# Altium schematic sheet STM32H750IBK6.SchDoc
size A2; SheetNumber: 1; SheetTotal: 2
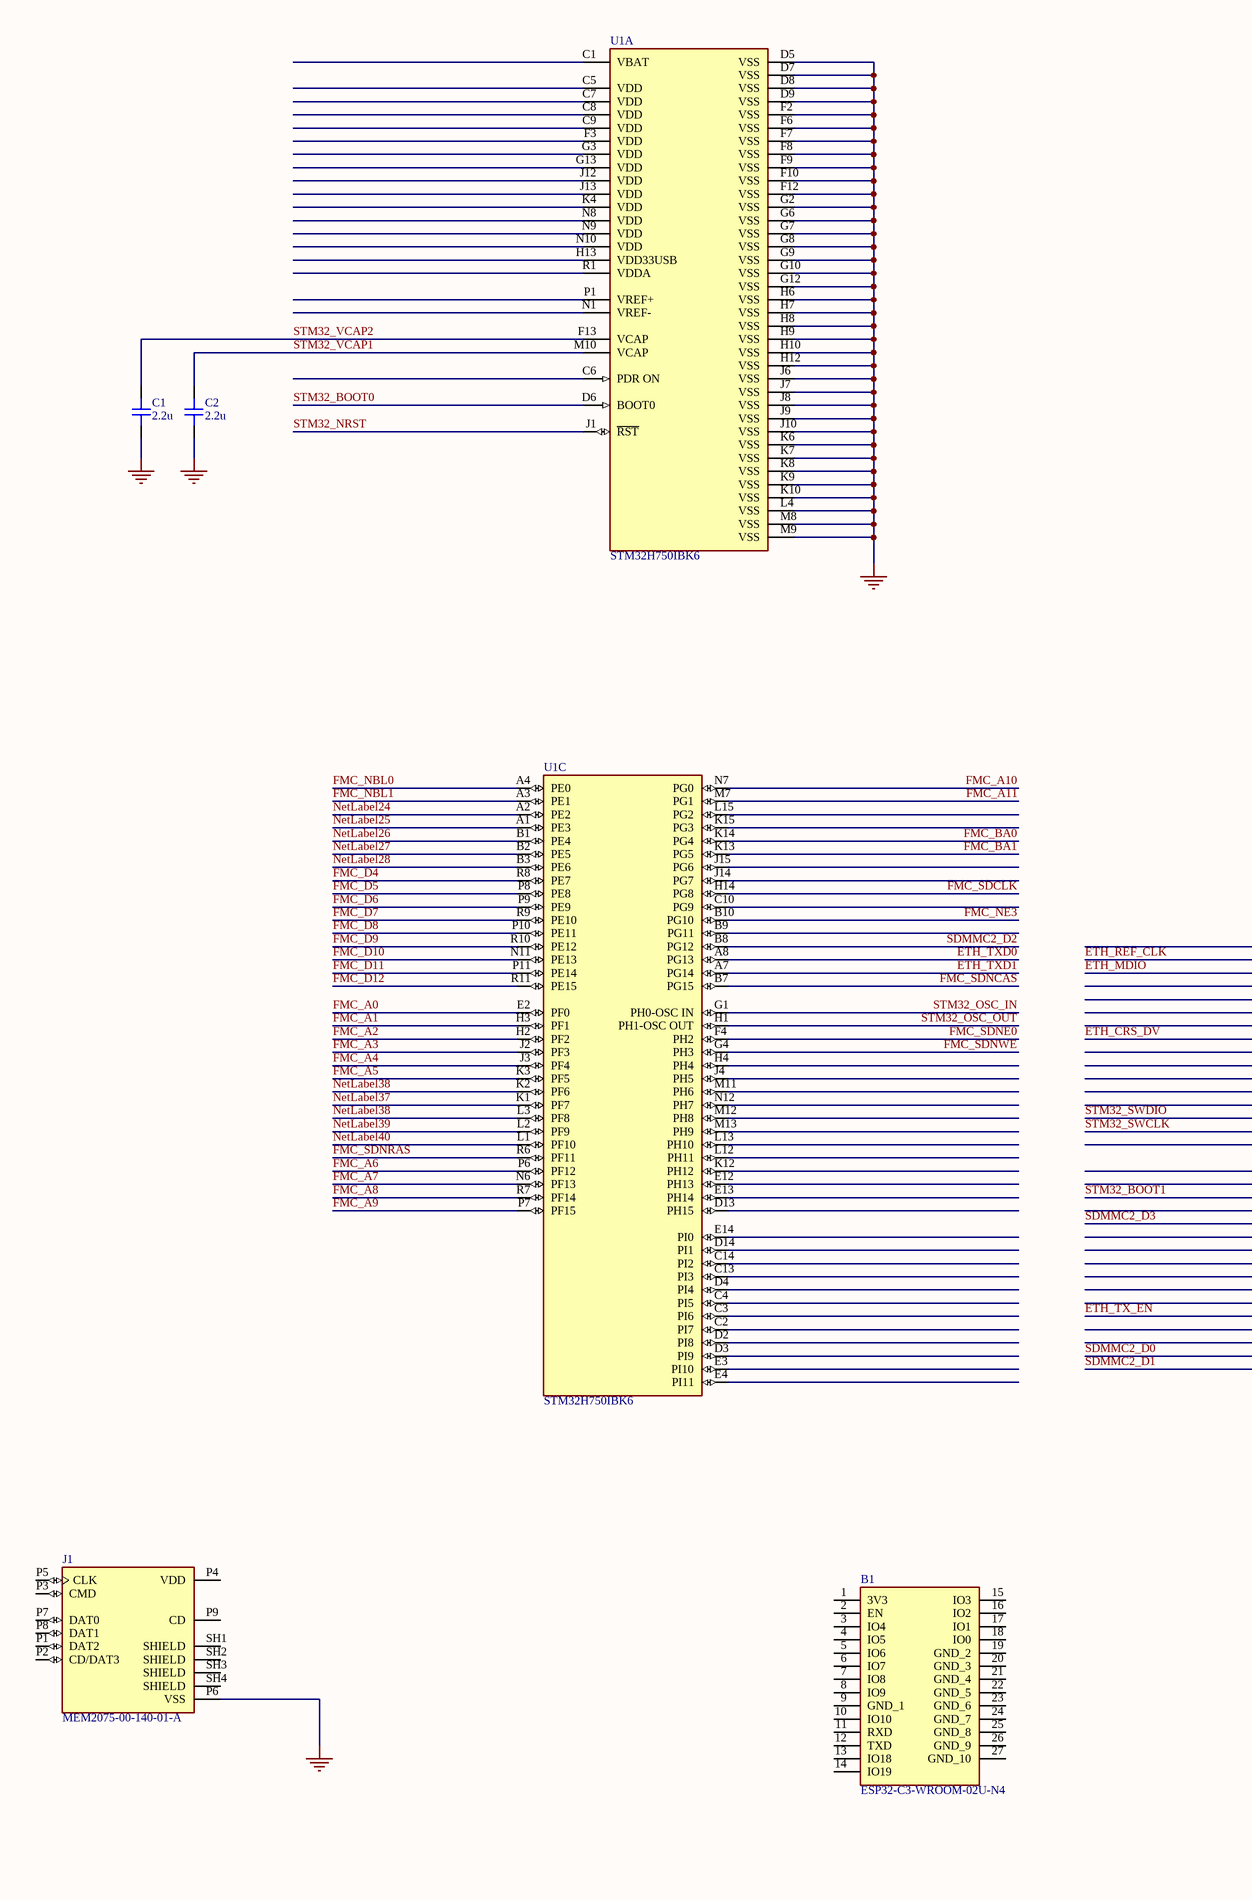
[diagram p0: STM32H750IBK6.SchDoc, left]
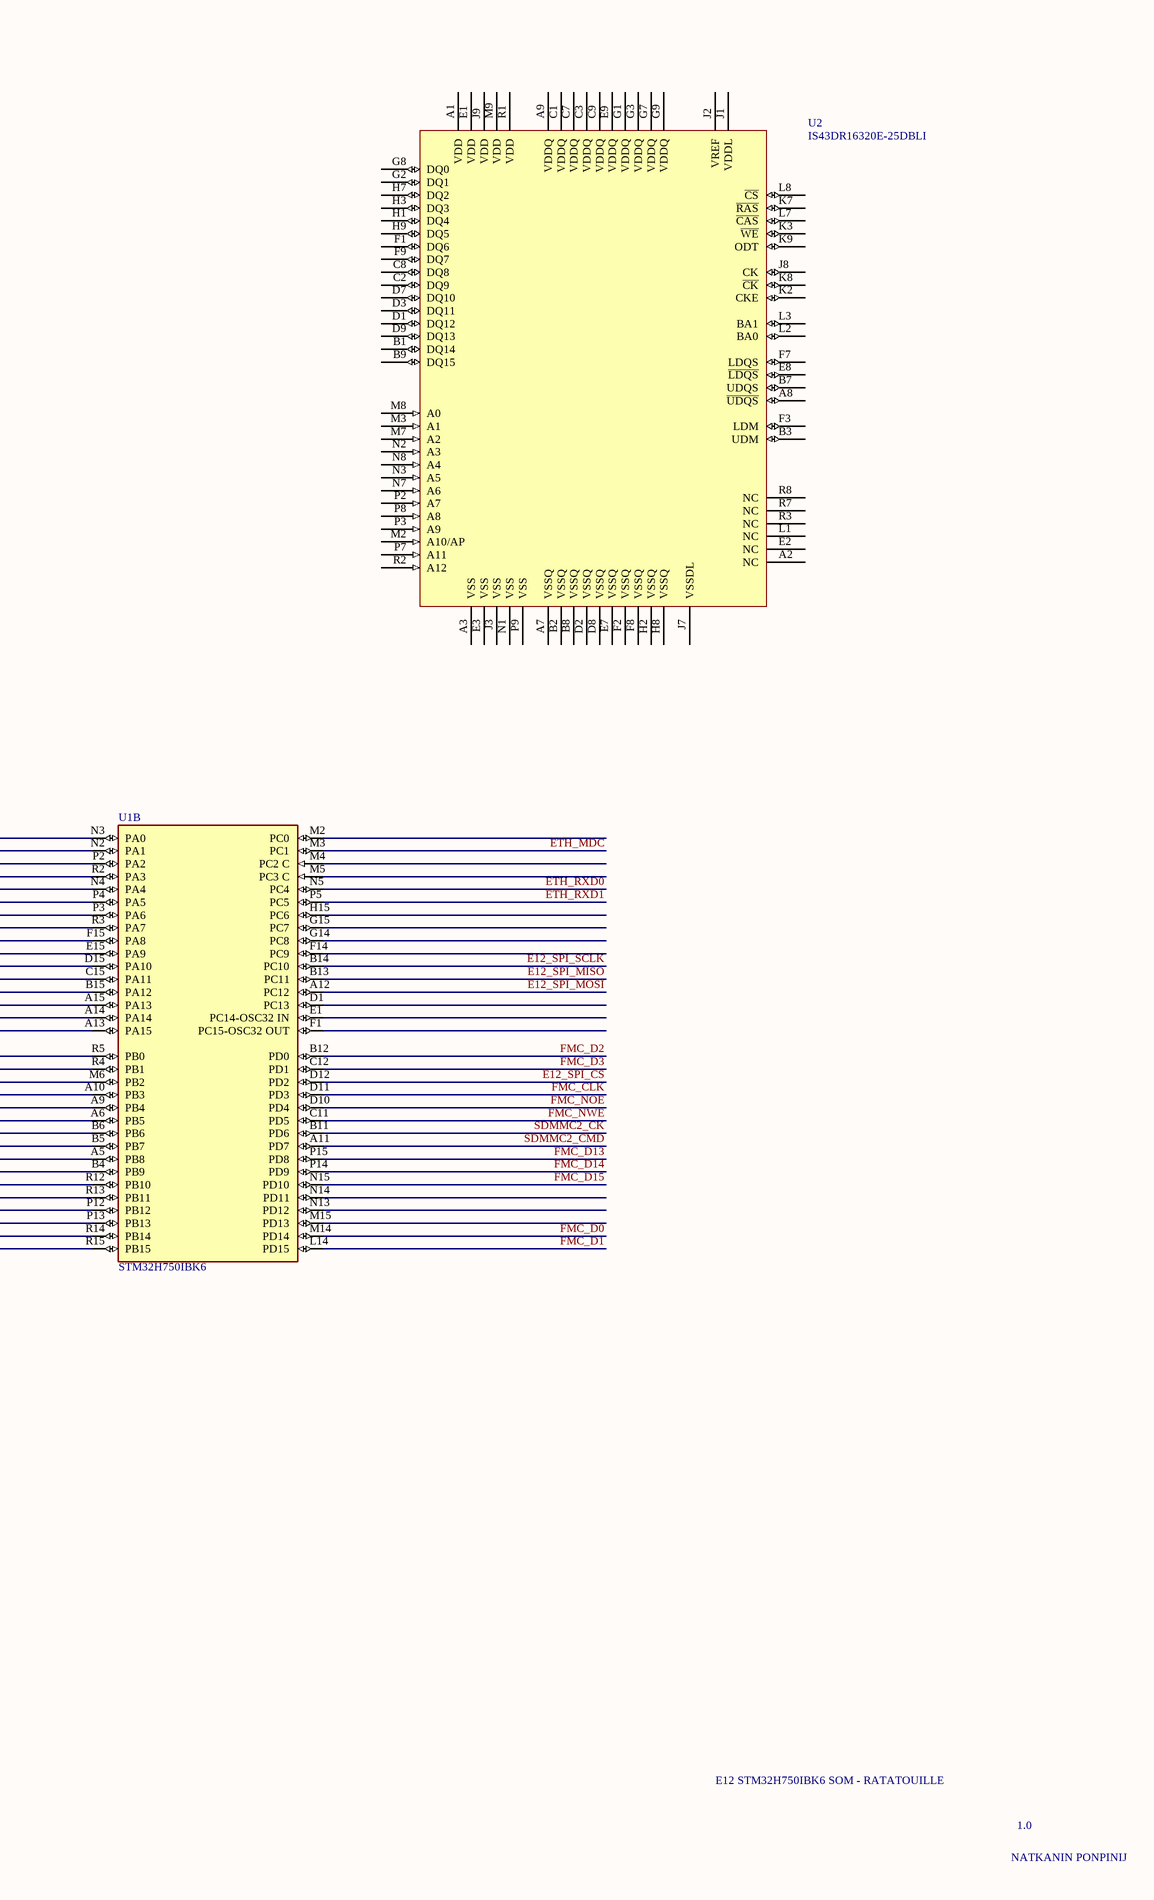
[diagram p1: STM32H750IBK6.SchDoc, right]

## Parts
B1  ESP32-C3-WROOM-02U-N4  [ESP32C3WROOM02UN4]
C1  2.2u  [CAP_0402]
C2  2.2u  [CAP_0402]
J1  MEM2075-00-140-01-A  [GCT_MEM2075-00-140-01-A]
U1  STM32H750IBK6  [FP-UFBGA176+25-A0E7-MFG]  (parts A,B,C of 3)
U2  IS43DR16320E-25DBLI  [BGA84C80P9X15_800X1250X120]

## Nets
GND: C1.1 C2.1 J1.P6(VSS) U1.D5(VSS) U1.D7(VSS) U1.D8(VSS) U1.D9(VSS) U1.F2(VSS) U1.F6(VSS) U1.F7(VSS) U1.F8(VSS) U1.F9(VSS) U1.F10(VSS) U1.F12(VSS) U1.G2(VSS) U1.G6(VSS) U1.G7(VSS) U1.G8(VSS) U1.G9(VSS) U1.G10(VSS) U1.G12(VSS) U1.H6(VSS) U1.H7(VSS) U1.H8(VSS) U1.H9(VSS) U1.H10(VSS) U1.H12(VSS) U1.J6(VSS) U1.J7(VSS) U1.J8(VSS) U1.J9(VSS) U1.J10(VSS) U1.K6(VSS) U1.K7(VSS) U1.K8(VSS) U1.K9(VSS) U1.K10(VSS) U1.L4(VSS) U1.M8(VSS) U1.M9(VSS)
E12_SPI_CS: U1.D12(PD2)
E12_SPI_MISO: U1.B13(PC11)
E12_SPI_MOSI: U1.A12(PC12)
E12_SPI_SCLK: U1.B14(PC10)
ETH_CRS_DV: U1.R3(PA7)
ETH_MDC: U1.M3(PC1)
ETH_MDIO: U1.P2(PA2)
ETH_REF_CLK: U1.N2(PA1)
ETH_RXD0: U1.N5(PC4)
ETH_RXD1: U1.P5(PC5)
ETH_TX_EN: U1.R13(PB11)
ETH_TXD0: U1.A8(PG13)
ETH_TXD1: U1.A7(PG14)
FMC_A0: U1.E2(PF0)
FMC_A1: U1.H3(PF1)
FMC_A2: U1.H2(PF2)
FMC_A3: U1.J2(PF3)
FMC_A4: U1.J3(PF4)
FMC_A5: U1.K3(PF5)
FMC_A6: U1.P6(PF12)
FMC_A7: U1.N6(PF13)
FMC_A8: U1.R7(PF14)
FMC_A9: U1.P7(PF15)
FMC_A10: U1.N7(PG0)
FMC_A11: U1.M7(PG1)
FMC_BA0: U1.K14(PG4)
FMC_BA1: U1.K13(PG5)
FMC_CLK: U1.D11(PD3)
FMC_D0: U1.M14(PD14)
FMC_D1: U1.L14(PD15)
FMC_D2: U1.B12(PD0)
FMC_D3: U1.C12(PD1)
FMC_D4: U1.R8(PE7)
FMC_D5: U1.P8(PE8)
FMC_D6: U1.P9(PE9)
FMC_D7: U1.R9(PE10)
FMC_D8: U1.P10(PE11)
FMC_D9: U1.R10(PE12)
FMC_D10: U1.N11(PE13)
FMC_D11: U1.P11(PE14)
FMC_D12: U1.R11(PE15)
FMC_D13: U1.P15(PD8)
FMC_D14: U1.P14(PD9)
FMC_D15: U1.N15(PD10)
FMC_NBL0: U1.A4(PE0)
FMC_NBL1: U1.A3(PE1)
FMC_NE3: U1.B10(PG10)
FMC_NOE: U1.D10(PD4)
FMC_NWE: U1.C11(PD5)
FMC_SDCLK: U1.H14(PG8)
FMC_SDNCAS: U1.B7(PG15)
FMC_SDNE0: U1.F4(PH2)
FMC_SDNRAS: U1.R6(PF11)
FMC_SDNWE: U1.G4(PH3)
NetLabel24: U1.A2(PE2)
NetLabel25: U1.A1(PE3)
NetLabel26: U1.B1(PE4)
NetLabel27: U1.B2(PE5)
NetLabel28: U1.B3(PE6)
NetLabel37: U1.K1(PF7)
NetLabel38: U1.K2(PF6) U1.L3(PF8)
NetLabel39: U1.L2(PF9)
NetLabel40: U1.L1(PF10)
SDMMC2_CK: U1.B11(PD6)
SDMMC2_CMD: U1.A11(PD7)
SDMMC2_D0: U1.R14(PB14)
SDMMC2_D1: U1.R15(PB15)
SDMMC2_D2: U1.B8(PG12)
SDMMC2_D3: U1.A9(PB4)
STM32_BOOT0: U1.D6(BOOT0)
STM32_BOOT1: U1.M6(PB2)
STM32_NRST: U1.J1(~{RST})
STM32_OSC_IN: U1.G1(PH0-OSC_IN)
STM32_OSC_OUT: U1.H1(PH1-OSC_OUT)
STM32_SWCLK: U1.A14(PA14)
STM32_SWDIO: U1.A15(PA13)
STM32_VCAP1: C2.2 U1.M10(VCAP)
STM32_VCAP2: C1.2 U1.F13(VCAP)

Not connected (* = marked no-connect by the designer): B1 1(3V3) 2(EN) 3(IO4) 4(IO5) 5(IO6) 6(IO7) 7(IO8) 8(IO9) 9(GND_1) 10(IO10) 11(RXD) 12(TXD) 13(IO18) 14(IO19) 15(IO3) 16(IO2) 17(IO1) 18(IO0) 19(GND_2) 20(GND_3) 21(GND_4) 22(GND_5) 23(GND_6) 24(GND_7) 25(GND_8) 26(GND_9) 27(GND_10); J1 P1(DAT2) P2(CD/DAT3) P3(CMD) P4(VDD) P5(CLK) P7(DAT0) P8(DAT1) P9(CD) SH1(SHIELD) SH2(SHIELD) SH3(SHIELD) SH4(SHIELD); U1 A5(PB8) A6(PB5) A10(PB3) A13(PA15) B4(PB9) B5(PB7) B6(PB6) B9(PG11) B15(PA12) C1(VBAT) C2(PI7) C3(PI6) C4(PI5) C5(VDD) C6(PDR_ON) C7(VDD) C8(VDD) C9(VDD) C10(PG9) C13(PI3) C14(PI2) C15(PA11) D1(PC13) D2(PI8) D3(PI9) D4(PI4) D13(PH15) D14(PI1) D15(PA10) E1(PC14-OSC32_IN) E3(PI10) E4(PI11) E12(PH13) E13(PH14) E14(PI0) E15(PA9) F1(PC15-OSC32_OUT) F3(VDD) F14(PC9) F15(PA8) G3(VDD) G13(VDD) G14(PC8) G15(PC7) H4(PH4) H13(VDD33USB) H15(PC6) J4(PH5) J12(VDD) J13(VDD) J14(PG7) J15(PG6) K4(VDD) K12(PH12) K15(PG3) L12(PH11) L13(PH10) L15(PG2) M2(PC0) M4(PC2_C) M5(PC3_C) M11(PH6) M12(PH8) M13(PH9) M15(PD13) N1(VREF-) N3(PA0) N4(PA4) N8(VDD) N9(VDD) N10(VDD) N12(PH7) N13(PD12) N14(PD11) P1(VREF+) P3(PA6) P4(PA5) P12(PB12) P13(PB13) R1(VDDA) R2(PA3) R4(PB1) R5(PB0) R12(PB10); U2 A1(VDD) A2(NC) A3(VSS) A7(VSSQ) A8(~{UDQS}) A9(VDDQ) B1(DQ14) B2(VSSQ) B3(UDM) B7(UDQS) B8(VSSQ) B9(DQ15) C1(VDDQ) C2(DQ9) C3(VDDQ) C7(VDDQ) C8(DQ8) C9(VDDQ) D1(DQ12) D2(VSSQ) D3(DQ11) D7(DQ10) D8(VSSQ) D9(DQ13) E1(VDD) E2(NC) E3(VSS) E7(VSSQ) E8(~{LDQS}) E9(VDDQ) F1(DQ6) F2(VSSQ) F3(LDM) F7(LDQS) F8(VSSQ) F9(DQ7) G1(VDDQ) G2(DQ1) G3(VDDQ) G7(VDDQ) G8(DQ0) G9(VDDQ) H1(DQ4) H2(VSSQ) H3(DQ3) H7(DQ2) H8(VSSQ) H9(DQ5) J1(VDDL) J2(VREF) J3(VSS) J7(VSSDL) J8(CK) J9(VDD) K2(CKE) K3(~{WE}) K7(~{RAS}) K8(~{CK}) K9(ODT) L1(NC) L2(BA0) L3(BA1) L7(~{CAS}) L8(~{CS}) M2(A10/AP) M3(A1) M7(A2) M8(A0) M9(VDD) N1(VSS) N2(A3) N3(A5) N7(A6) N8(A4) P2(A7) P3(A9) P7(A11) P8(A8) P9(VSS) R1(VDD) R2(A12) R3(NC) R7(NC) R8(NC)

## Notes on the sheet
- E12 STM32H750IBK6 SOM - RATATOUILLE
- NATKANIN PONPINIJ
- 1.0

## Library data of the parts
B1 = ESP32-C3-WROOM-02U-N4: Multiprotocol Modules SMD module, ESP32-C3, 4MB SPI flash, IPEX antenna, -40 C +85 C; Manufacturer_Name: Espressif Systems; Geometry.Height: 3.35mm; Manufacturer_Part_Number: ESP32-C3-WROOM-02U-N4; Mouser Part Number: 356-ESP32C3WROM02UN4; Mouser Price/Stock: https://www.mouser.co.uk/ProductDetail/Espressif-Systems/ESP32-C3-WROOM-02U-N4?qs=pBJMDPsKWf2Ces2aXBSNjQ%3D%3D; Arrow Part Number: *; Arrow Price/Stock: *; Datasheet Link: https://www.espressif.com/sites/default/files/documentation/esp32-c3-wroom-02_datasheet_en.pdf
C1 C2 = CAP_0402_10V: Capacitor SMD 0402 10V
J1 = MEM2075-00-140-01-A: Micro SD Memory Card Connector, 1.4mm Profile SMT, Push-Push, with Normally open Switch; MP: MEM2075-00-140-01-A; Value: *; Price: None; Package: None; Availability: Unavailable
U1 = CMP-12105-000026-1: IC MCU 32BIT 128KB FLASH 176UBGA; Manufacturer: STMicroelectronics; Core Architecture: ARM Cortex-M7; Frequency: 480MHz; Memory Size: 128KBytes; Ram Size: 1MBytes; Number Of Cores: 1; Number Of Timers/Counters: 20; Max Junction Temp: +125°C; Number Of Uart Channels: 9; Number Of Pwm Channels: 42; Number Of Usb Channels: 2; Number Of I/Os: 140; Interface: I2C,SPI,UART,USART,CAN,USB,LIN,IrDA,Ethernet,I2S,Other; Number Of Spi Channels: 6; Max Supply Voltage: 3.6V; Data Bus Width: 32bits; Number Of A/D Converters: 3; Number Of Adc Channels: 36; Number Of I2C Channels: 4; Min Supply Voltage: 1.62V; Mouser Description: MCU 32-Bit STM32H750IB ARM Cortex M7 RISC 128KB Flash 1.8V/2.5V/3.3V 176-Pin UFBGA Tray; Automotive: No; Manufacturer Part Number: STM32H750IBK6; Ambient Temperature Range High: +85°C; Category: IC; Temperature Range High: +125°C; ComponentLink2Description: Datasheet; Lead Free: Yes; Device Class L2: Embedded Processors and Controllers; Temperature: -40°C to +125°C; Ambient Temperature Range Low: -40°C; Digikey Description: IC MCU 32BIT 128KB FLASH 176UBGA; Height: 0.6mm; Memory Type: FLASH; Octopart: https://octopart.com/stm32h750ibk6-stmicroelectronics-94048546; ComponentLink2URL: https://www.st.com/resource/en/datasheet/stm32h750vb.pdf; Ipc Land Pattern Name: BGA225N65P15X15_1015X1015X60; Device Class L3: Microcontrollers; RoHS: TRUE; Package: UFBGA176+25-A0E7; Device Class L1: Integrated Circuits (ICs); Number Of Ethernet Channels: 1; Temperature Range Low: -40°C
U2 = CMP-025-000000-1: Source: 1.SchLib; Design Item ID: IS43DR16320E-25DBLI-Symbol-1